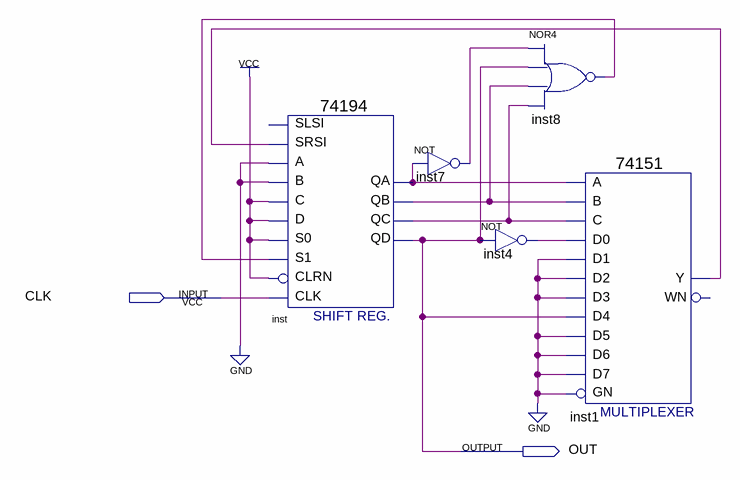
[diagram p0: schematic sheet]
// Quartus schematic 74194_SeqGenerator.bdf as structural Verilog: 5 symbols, 2 pins
module \74194_SeqGenerator  (
  input  CLK,
  output OUT
);

  wire inst1_y, inst4_out, inst7_out, inst8_out, inst_qa, inst_qb, inst_qc;

  \74194  inst (
    .SRSI(inst1_y), .B(1'b0), .C(1'b1), .CLK(CLK), .CLRN(1'b1), .D(1'b1), .S1(inst8_out), .S0(1'b1),
    .A(1'b0), .QA(inst_qa), .QB(inst_qb), .QC(inst_qc), .QD(OUT));  // open: SLSI
  not inst7 (inst7_out, inst_qa);
  not inst4 (inst4_out, OUT);
  nor inst8 (inst8_out, inst7_out, OUT, inst_qb, inst_qc);
  \74151  inst1 (
    .GN(1'b0), .C(inst_qc), .B(inst_qb), .A(inst_qa), .D5(1'b0), .D0(inst4_out), .D1(1'b0), .D4(OUT),
    .D3(1'b0), .D2(1'b0), .D6(1'b0), .D7(1'b0), .Y(inst1_y));  // open: WN
endmodule
